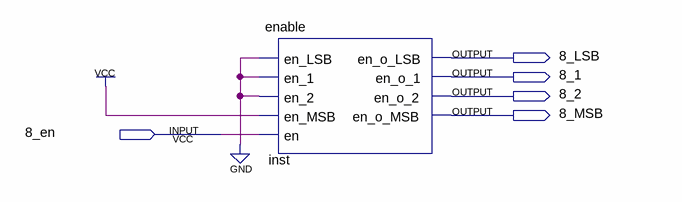
[diagram p0: schematic sheet]
// Quartus schematic 8_en.bdf as structural Verilog: 1 symbols, 5 pins
module \8_en  (
  input  \8_en ,
  output \8_LSB ,
  output \8_1 ,
  output \8_2 ,
  output \8_MSB 
);

  enable inst (
    .en_LSB(1'b0), .en_1(1'b0), .en_2(1'b0), .en_MSB(1'b1), .en(\8_en ), .en_o_LSB(\8_LSB ), .en_o_1(\8_1 ),
    .en_o_2(\8_2 ), .en_o_MSB(\8_MSB ));
endmodule
